# Altium schematic sheet Microcontroller.SchDoc: Microcontroller
size A4; DrawnBy: oaba200; Revision: V1.0
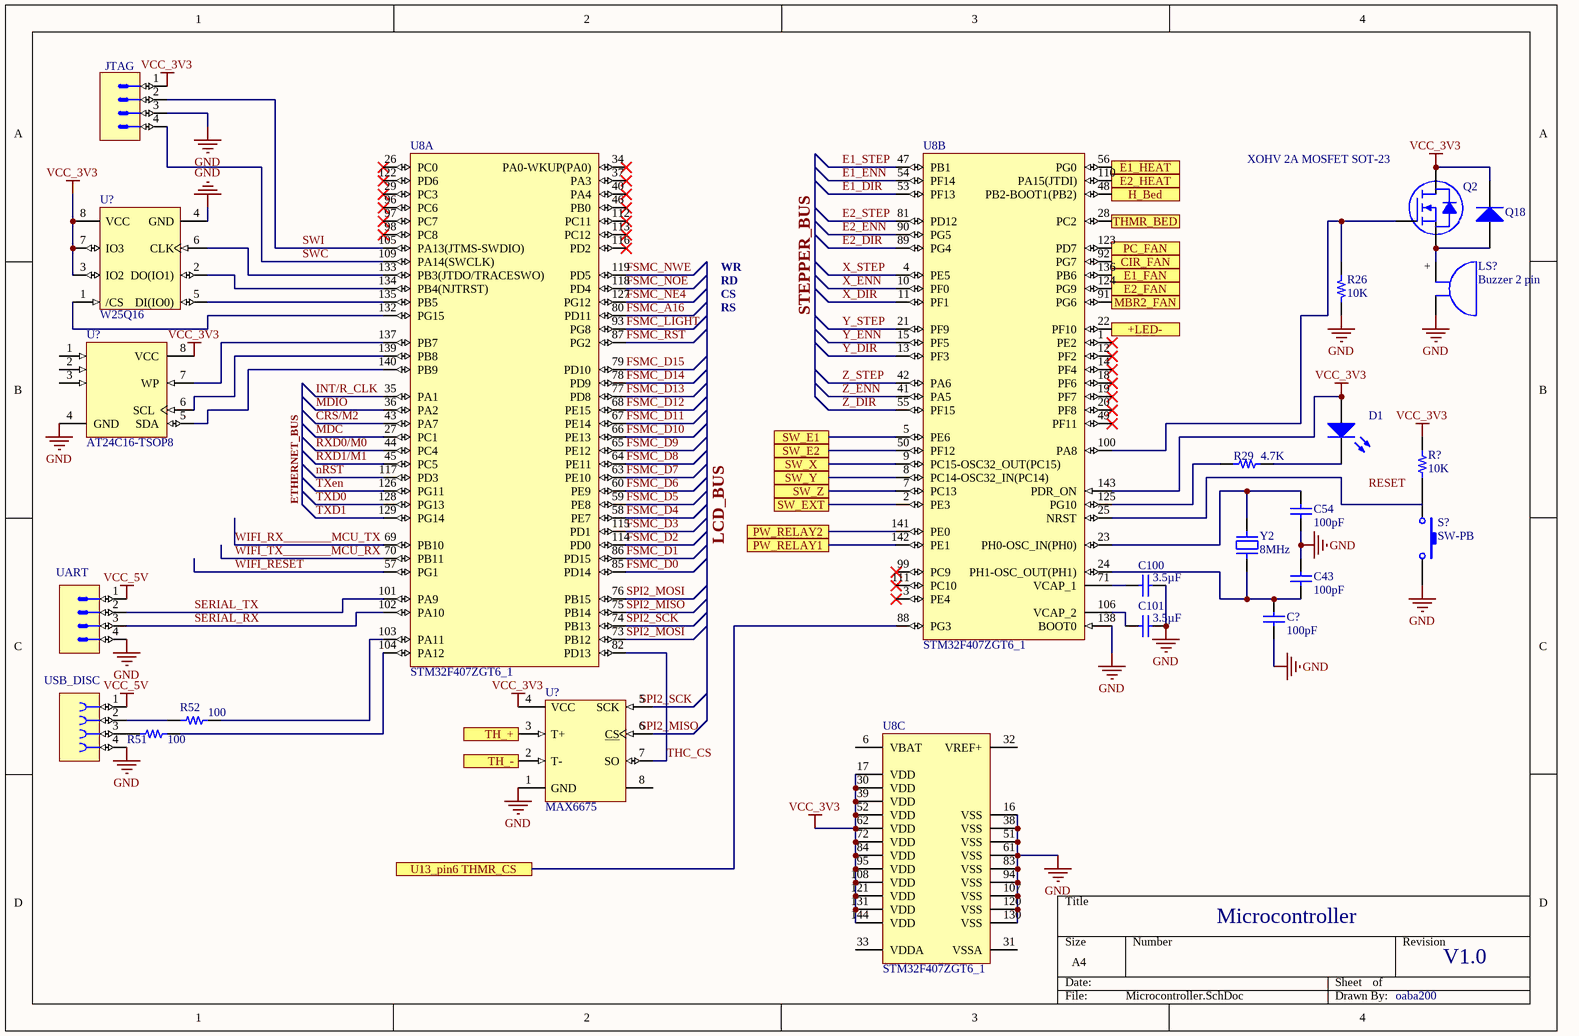
[diagram p0: Microcontroller.SchDoc]

## Parts
(Parts that share a designator on the sheet are numbered #1, #2 ... from top to bottom, then left to right.)
C43  value 100pF  [C1206]  (hidden comment: Cap Semi)
C54  value 100pF  [C1206]  (hidden comment: Cap Semi)
C100  value 3.5µF  [C1206]  (hidden comment: Cap Semi)
C101  value 3.5µF  [C1206]  (hidden comment: Cap Semi)
C?  value 100pF  [C1206]  (hidden comment: Cap Semi)
D1  LED3  [3.5X2.8X1.9]  (value not drawn)
JTAG  (no value)
LS?  Buzzer 2 pin
Q2  XOHV 2A MOSFET SOT-23
Q18  Diode 1N4148  [DO-35]  (value not drawn)
R26  10K  [RES 0805_2012]
R29  4.7K  [RES 0805_2012]
R51  100  [RES 0805_2012]
R52  100  [RES 0805_2012]
R?  10K  [RES 0805_2012]
S?  SW-PB  [SPST-2]
U8  STM32F407ZGT6_1  [STM-LQFP144_N]  (parts A,B,C of 3)
U?#1  W25Q16  [SOIC8]
U?#2  AT24C16-TSOP8  [8A2_N]
U?#3  MAX6675  [SOIC8]
UART  (no value)
USB_DISC  (no value)
Y2  8MHz

## Ports
+LED-, CIR_FAN, E1_FAN, E1_HEAT, E2_FAN, E2_HEAT, H_Bed, MBR2_FAN, PC_FAN, PW_RELAY1, PW_RELAY2, SW_E1, SW_E2, SW_EXT, SW_X, SW_Y, SW_Z, TH_+, TH_-, THMR_BED, U13_pin6 THMR_CS

## Nets
GND: C43.1 C54.2 C100.2 C101.2 C?.2 JTAG.3 LS?.- R26.1 S?.2 U8.16(VSS) U8.38(VSS) U8.51(VSS) U8.61(VSS) U8.83(VSS) U8.94(VSS) U8.107(VSS) U8.120(VSS) U8.130(VSS) U8.138(BOOT0) U?#1.4(GND) U?#2.4(GND) U?#3.1(GND) UART.4 USB_DISC.4
VCC_3V3: D1.1(A) JTAG.1 Q2.3(D) Q18.2(K) R?.2 U8.17(VDD) U8.30(VDD) U8.39(VDD) U8.52(VDD) U8.62(VDD) U8.72(VDD) U8.84(VDD) U8.95(VDD) U8.108(VDD) U8.121(VDD) U8.131(VDD) U8.143(PDR_ON) U8.144(VDD) U?#1.3(IO2) U?#1.7(IO3) U?#1.8(VCC) U?#2.8(VCC) U?#3.4(VCC)
VCC_5V: UART.1 USB_DISC.1
+LED-: U8.22(PF10) ; port +LED-
CIR_FAN: U8.92(PG7) ; port CIR_FAN
CRS/M2: U8.43(PA7)
E1_DIR: U8.53(PF13)
E1_ENN: U8.54(PF14)
E1_FAN: U8.136(PB6) ; port E1_FAN
E1_HEAT: U8.56(PG0) ; port E1_HEAT
E1_STEP: U8.47(PB1)
E2_DIR: U8.89(PG4)
E2_ENN: U8.90(PG5)
E2_FAN: U8.124(PG9) ; port E2_FAN
E2_HEAT: U8.110(PA15(JTDI)) ; port E2_HEAT
E2_STEP: U8.81(PD12)
FSMC_A16: U8.80(PD11)
FSMC_D0: U8.85(PD14)
FSMC_D1: U8.86(PD15)
FSMC_D2: U8.114(PD0)
FSMC_D3: U8.115(PD1)
FSMC_D4: U8.58(PE7)
FSMC_D5: U8.59(PE8)
FSMC_D6: U8.60(PE9)
FSMC_D7: U8.63(PE10)
FSMC_D8: U8.64(PE11)
FSMC_D9: U8.65(PE12)
FSMC_D10: U8.66(PE13)
FSMC_D11: U8.67(PE14)
FSMC_D12: U8.68(PE15)
FSMC_D13: U8.77(PD8)
FSMC_D14: U8.78(PD9)
FSMC_D15: U8.79(PD10)
FSMC_LIGHT: U8.93(PG8)
FSMC_NE4: U8.127(PG12)
FSMC_NOE: U8.118(PD4)
FSMC_NWE: U8.119(PD5)
FSMC_RST: U8.87(PG2)
H_Bed: U8.48(PB2-BOOT1(PB2)) ; port H_Bed
INT/R_CLK: U8.35(PA1)
MBR2_FAN: U8.91(PG6) ; port MBR2_FAN
MDC: U8.27(PC1)
MDIO: U8.36(PA2)
nRST: U8.117(PD3)
PC_FAN: U8.123(PD7) ; port PC_FAN
PW_RELAY1: U8.142(PE1) ; port PW_RELAY1
PW_RELAY2: U8.141(PE0) ; port PW_RELAY2
RXD0/M0: U8.44(PC4)
RXD1/M1: U8.45(PC5)
SERIAL_RX: U8.102(PA10) UART.3
SERIAL_TX: U8.101(PA9) UART.2
SPI2_MISO: U8.75(PB14)
SPI2_MOSI: U8.73(PB12) U8.76(PB15)
SPI2_SCK: U8.74(PB13)
SW_E1: U8.5(PE6) ; port SW_E1
SW_E2: U8.50(PF12) ; port SW_E2
SW_EXT: U8.2(PE3) ; port SW_EXT
SW_X: U8.9(PC15-OSC32_OUT(PC15)) ; port SW_X
SW_Y: U8.8(PC14-OSC32_IN(PC14)) ; port SW_Y
SW_Z: U8.7(PC13) ; port SW_Z
SWC: JTAG.4 U8.109(PA14(SWCLK))
SWI: JTAG.2 U8.105(PA13(JTMS-SWDIO))
TH_+: U?#3.3(T+) ; port TH_+
TH_-: U?#3.2(T-) ; port TH_-
THC_CS: U8.82(PD13) U?#3.7(SO)
THMR_BED: U8.28(PC2) ; port THMR_BED
TXD0: U8.128(PG13)
TXD1: U8.129(PG14)
TXen: U8.126(PG11)
U13_pin6 THMR_CS: U8.88(PG3) ; port U13_pin6 THMR_CS
WIFI_RESET: U8.57(PG1)
WIFI_RX________MCU_TX: U8.69(PB10)
WIFI_TX________MCU_RX: U8.70(PB11)
X_DIR: U8.11(PF1)
X_ENN: U8.10(PF0)
X_STEP: U8.4(PE5)
Y_DIR: U8.13(PF3)
Y_ENN: U8.15(PF5)
Y_STEP: U8.21(PF9)
Z_DIR: U8.55(PF15)
Z_ENN: U8.41(PA5)
Z_STEP: U8.42(PA6)
NetC43_2: C43.2 C?.1 U8.24(PH1-OSC_OUT(PH1)) Y2.1
NetC54_1: C54.1 U8.23(PH0-OSC_IN(PH0)) Y2.2
NetC100_1: C100.1 U8.71(VCAP_1)
NetC101_1: C101.1 U8.106(VCAP_2)
NetD1_2: D1.2(K) R29.1
NetLS?_+: LS?.+ Q2.2(S) Q18.1(A)
NetQ2_1: Q2.1(G) R26.2 U8.100(PA8)
NetR29_2: R29.2 U8.125(PG10)
NetR51_1: R51.1 USB_DISC.3
NetR51_2: R51.2 U8.104(PA12)
NetR52_1: R52.1 USB_DISC.2
NetR52_2: R52.2 U8.103(PA11)
NetR?_1: R?.1 S?.1
NetU8_132: U8.132(PG15) U?#1.1(/CS)
NetU8_133: U8.133(PB3(JTDO/TRACESWO)) U?#1.6(CLK)
NetU8_134: U8.134(PB4(NJTRST)) U?#1.2(DO(IO1))
NetU8_135: U8.135(PB5) U?#1.5(DI(IO0))
NetU8_137: U8.137(PB7) U?#2.7(WP)
NetU8_139: U8.139(PB8) U?#2.6(SCL)
NetU8_140: U8.140(PB9) U?#2.5(SDA)

Not connected (* = marked no-connect by the designer): U8 1(PE2)* 3(PE4)* 6(VBAT) 12(PF2)* 14(PF4)* 18(PF6)* 19(PF7)* 20(PF8)* 25(NRST) 26(PC0)* 29(PC3)* 31(VSSA) 32(VREF+) 33(VDDA) 34(PA0-WKUP(PA0))* 37(PA3)* 40(PA4)* 46(PB0)* 49(PF11)* 96(PC6)* 97(PC7)* 98(PC8)* 99(PC9)* 111(PC10)* 112(PC11)* 113(PC12)* 116(PD2)* 122(PD6)*; U?#2 1 2 3; U?#3 5(SCK) 6(CS) 8

## Buses and harness runs
bus ETHERNET_BUS
bus LCD_BUS
bus STEPPER_BUS

## Notes on the sheet
- WR
- RD
- CS
- RS
- Labels drawn without touching a wire or pin: RESET, SPI2_MISO, SPI2_SCK

## Library data of the parts
C43 C54 C100 C101 C? = Cap Semi: Capacitor (Semiconductor SIM Model); Published: 8-Jun-2000; LatestRevisionDate: 29-May-2009; LatestRevisionNote: IPC-7351 Footprint Added.; PackageReference: C1206; Publisher: Altium Limited; PackageDescription: Chip Capacitor
D1 = LED3: Typical BLUE SiC LED; Published: 8-Jun-2000; LatestRevisionDate: 17-Dec-2003; LatestRevisionNote: PCB Footprint replaced.; DatasheetVersion: 16-Apr-2002; PackageVersion: 16-Apr-2002; PackageReference: 3.5X2.8X1.9; Publisher: Altium Limited; PackageDescription: SM LED; 2 C-Bend Leads; Body 3.5 x 2.8 x 1.9 mm, inc leads (LxWxH typ)
JTAG UART = Connector 4 Male
Q18 = Diode 1N4148: High Conductance Fast Diode; Published: 8-Jun-2000; LatestRevisionDate: 17-Jul-2002; LatestRevisionNote: Re-released for DXP Platform.; DatasheetVersion: 1997; PackageReference: DO-35; Publisher: Altium Limited; PackageDescription: Diode, Axial; Body 3.8 x 1.9 mm (LxDia. max), Lead Dia. 0.53 mm (max); Code_JEDEC: DO-204-AH; ComponentLink1Description: Manufacturer Link; ComponentLink1URL: http://www.fairchildsemi.com/; ComponentLink2Description: Datasheet; ComponentLink2URL: http://www.fairchildsemi.com/ds/1N%2F1N4148.pdf
R26 R29 R51 R52 R? = Resistor: SMT Resistor
  R26: VALUE: 10K
  R29: VALUE: 4.7K
  R51 R52: VALUE: 100
  R?: Value: 10K
S? = SW-PB: Switch; Published: 24-Mar-1999; LatestRevisionDate: 17-Jul-2002; LatestRevisionNote: Re-released for DXP Platform.; PackageReference: SPST-2; Publisher: Altium Limited; PackageDescription: Switch; 2 Leads
U8 = STM32F407ZGT6_1: V2 ARM Cortex-M4 32-bit MCU+FPU, 210 DMIPS, 1024 kB Flash, 192 kB Internal RAM, 114 I/Os, 144-pin LQFP, -40 to 85 degC, Tray; Manufacturer: STMicroelectronics; D/A Converter: 2x12-bit; FLASH Size (Prog) (kB): 1024; I/Os (High Current): 114; Internal RAM Size (kB): 192; Operating Frequency(F) (Processor speed) (MHz): 168; Supply Voltage(Vcc) max (V): 3.6; Supply Voltage(Vcc) min (V): 1.8; DatasheetVersion: Rev. 4; PackageVersion: Rev. 4, 06/2013; PackageReference: LQFP144; PackageDescription: 144-Pin Low Profile Quad Flat Package, 20 x 20 mm Body, 0.5 mm Pitch; Supplier 1: Digi-Key; Supplier Part Number 1: 497-11766-ND; Supplier 2: Newark; Supplier Part Number 2: 73T2334; Supplier 3: Mouser; Supplier Part Number 3: 511-STM32F407ZGT6; Core: ARM Cortex-M4; Packing: Tray; Mounting Technology: Surface Mount; PartNumber: STM32F407ZGT6; ComponentLink1Description: Manufacturer URL; ComponentLink1URL: http://www.st.com/web/en/home.html; ComponentLink2Description: Datasheet; ComponentLink2URL: http://www.st.com/st-web-ui/static/active/en/resource/technical/document/datasheet/DM00037051.pdf; ComponentLink3Description: Package Specification; ComponentLink3URL: http://www.st.com/st-web-ui/static/active/en/resource/technical/document/datasheet/DM00037051.pdf
U?#1 = W25Q16: FLASH - NOR Memory IC 16Mb _2M x 8_ SPI 104MHz 8-SOIC; MP: W25Q16BVSSIG; MF: Winbond; Availability: Unavailable; SnapEDA_Link: https://www.snapeda.com/parts/W25Q16BVSSIG/Winbond%20Electronics/view-part/512685/?ref=snap; Value: *; Price: None; Package: SOIC-8 Winbond
U?#2 = AT24C16-TSOP8: 1Kbit (128 x 8), 2-wire Bus Automotive Serial EEPROM with Write Protect, 2.5V, 8-Pin TSSOP, Bulk; Published: 20-Sep-2010; DatasheetVersion: 8517C,  Jan-2009; PackageVersion: revD, Dec-2009; PackageReference: 8A2; Publisher: Altium Limited; PackageDescription: 8-Lead, 4.4 mm Body, Plastic Thin Shrink Small Outline Package (TSSOP); Code_JEDEC: MO-153-AA; ComponentLink1Description: Manufacturer Link; ComponentLink1URL: http://www.atmel.com/products/serial/default.asp; ComponentLink2Description: Datasheet; ComponentLink2URL: http://www.atmel.com/dyn/resources/prod_documents/doc8517.pdf; ComponentLink3Description: Atmel.com Home; ComponentLink3URL: http://www.atmel.com
USB_DISC = Connector 4 Female
Y2 = Abracon Crystal ABS06: SMT Crystal; VALUE: 8MHz